# EasyEDA schematic SCH_Hunter_2024-12-30.json
TITLE: Hunter X-Core Monitor; REV: 1.0; Date: 2024-12-28; Sheet: 1/1; Drawn By: czsmith; Company: Christoher Smith
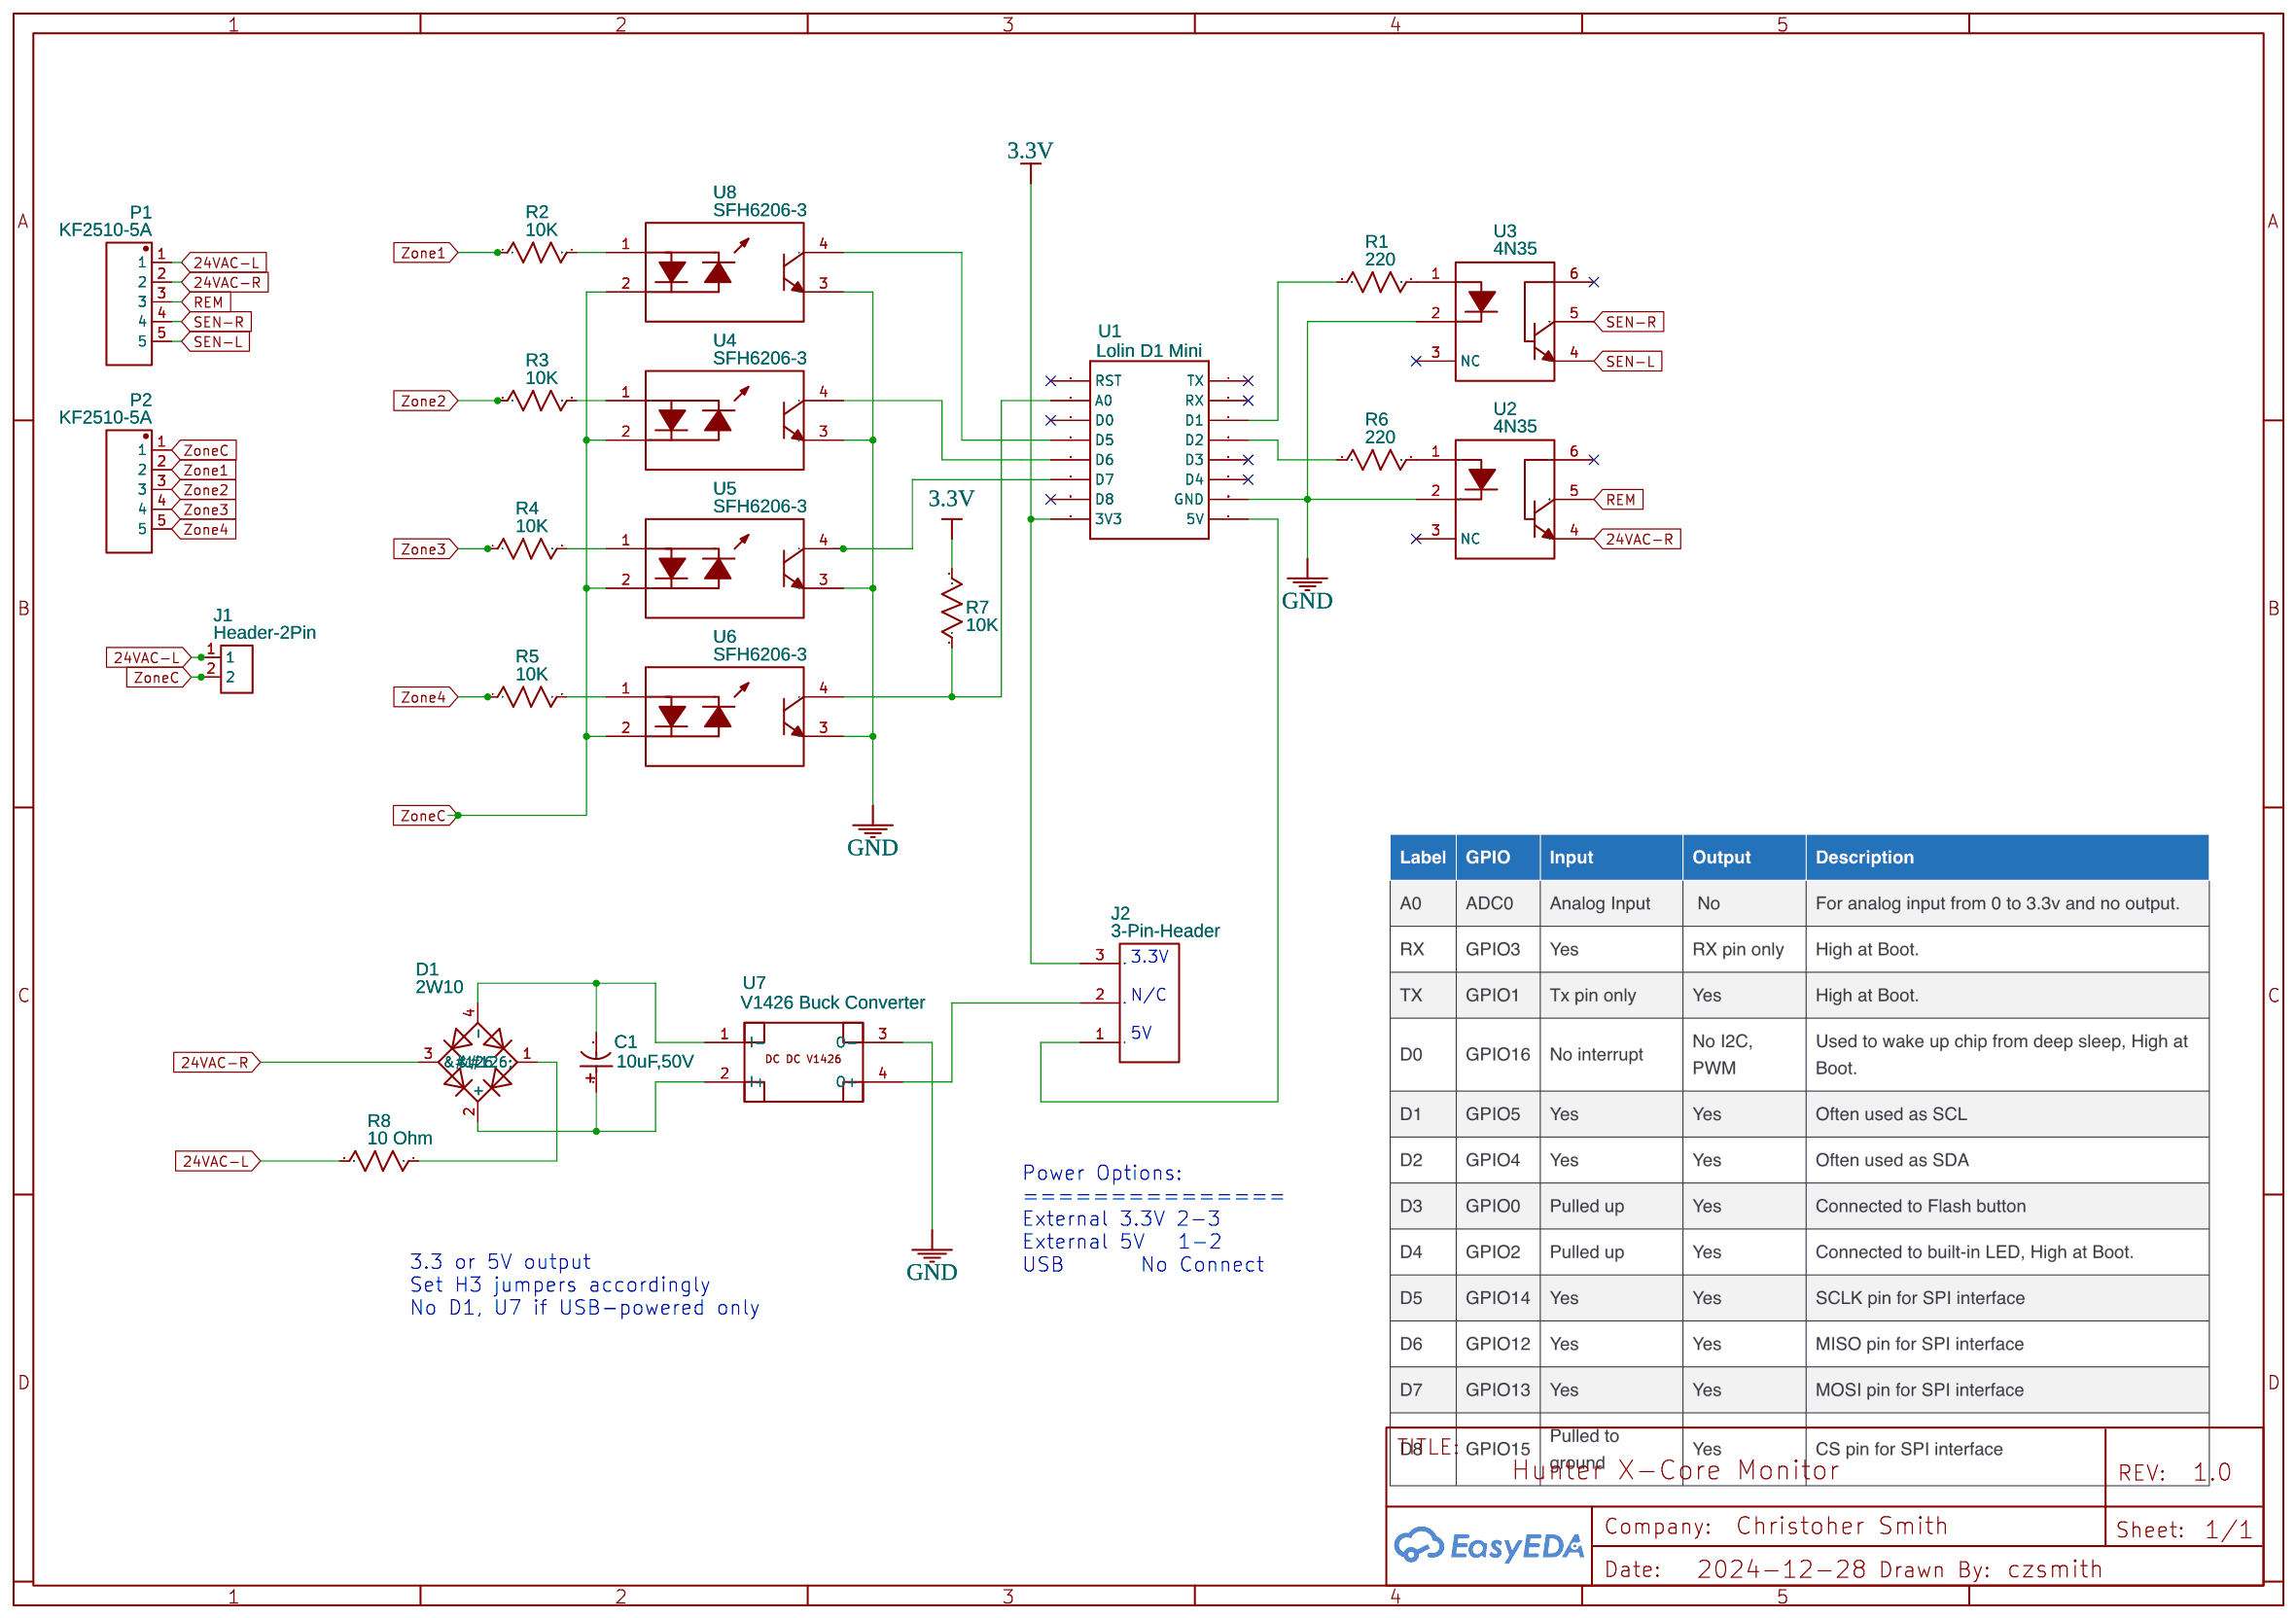
[diagram p0: schematic sheet]

## Parts
C1  10uF,50V  [CAP-TH_BD4.0-P1.50-D0.8-FD]
D1  2W10  [BRIDGE-WOB]
J1  Header-2Pin  [HEADER-2PIN]
J2  3-Pin-Header  [3-PIN-HEADER-FOOTPRINT]
P1  KF2510-5A  [CONN-TH_5P-P2.54_KF2510-5A]
P2  KF2510-5A  [CONN-TH_5P-P2.54_KF2510-5A]
R1  220  [R_AXIAL-0.4]
R2  10K  [R_AXIAL-0.4]
R3  10K  [R_AXIAL-0.4]
R4  10K  [R_AXIAL-0.4]
R5  10K  [R_AXIAL-0.4]
R6  220  [R_AXIAL-0.4]
R7  10K  [R_AXIAL-0.4]
R8  10 Ohm  [R_AXIAL-0.4]
U1  Lolin D1 Mini  [LOLIN D1 MINI]
U2  4N35  [DIP-6_L7.3-W6.5-P2.54-LS7.6-BL]
U3  4N35  [DIP-6_L7.3-W6.5-P2.54-LS7.6-BL]
U4  SFH6206-3  [DIP-4_L6.3-W5.0-P2.54-LS7.6-BL]
U5  SFH6206-3  [DIP-4_L6.3-W5.0-P2.54-LS7.6-BL]
U6  SFH6206-3  [DIP-4_L6.3-W5.0-P2.54-LS7.6-BL]
U7  V1426 Buck Converter  [V1426 CZS]
U8  SFH6206-3  [DIP-4_L6.3-W5.0-P2.54-LS7.6-BL]

## Library data of the parts
C1 = 4.7uF 50V 4*7: Supplier: LCSC; Manufacturer: CX(承兴); Manufacturer Part: KS475M050C07RR0VH2FP0; Supplier Part: C43841; JLCPCB Part Class: Extended Part
D1 = 2W10: Supplier: LCSC; Manufacturer: MDD; image: //image.lceda.cn/szlcsc/C3064.jpg; Supplier Part: C3064; link: D/doroteo; Contributor: Remedios Del Pozo
J1 = Header-2Pin: Manufacturer: Amphenol ICC (Commercial Products); Manufacturer Part: G800WC306018EU; Supplier Part: 664-G800WC306018EU-ND; Supplier: Digi-Key; link: https://www.digikey.kr/ko/products/detail/amphenol-icc-(commercial-products)/G800WC306018EU/17083163?utm_adgroup=&utm_source=google&utm_medium=cpc&utm_campaign=Pmax%20Shopping_Product_All&utm_term=&utm_content=&utm_id=go_cmp-21036528233_adg-_ad-__dev-c_ext-_prd-17083163_sig-Cj0KCQjw0Oq2BhCCARIsAA5hubWk9avkClM22Y4FmhcapBcfoQYxSe3OqXjJ02saBMR-8QIhNsJI0goaAoHpEALw_wcB&gad_source=1&gclid=Cj0KCQjw0Oq2BhCCARIsAA5hubWk9avkClM22Y4FmhcapBcfoQYxSe3OqXjJ02saBMR-8QIhNsJI0goaAoHpEALw_wcB; Contributor: wonkim
J2 = 3-Pin-Header: Supplier: reichelt; Contributor: Philipp
P1 P2 = KF2510-5A: Supplier: LCSC; Manufacturer: BOOMELE(博穆精密); Manufacturer Part: 2510-5A; Supplier Part: C27544; JLCPCB Part Class: Extended Part
R1-R8 = R_0603_US: Contributor: LCEDA_Lib; Package Display: No
U1 = Lolin D1 Mini: sourceId: YemgaslDx; Contributor: Marco Cè
U2 U3 = LTV-4N35: Contributor: LCSC; Supplier: LCSC; Supplier Part: C343878; Manufacturer: LITEON(光宝); JLCPCB Part Class: Extended Part
U4-U6 U8 = SFH6206-3: Supplier: LCSC; Supplier Part: C7473279; Manufacturer: VISHAY(威世); Contributor: lcsc; JLCPCB Part Class: Extended Part
U7 = DC DC Buck Stepdown 5-30V > 3.3V: Supplier: Ali Express; Contributor: obi9

## Nets
3.3V: J2.3 R7.2 U1.3V3
24VAC-L: J1.1 P1.1 R8.2
24VAC-R: D1.3(&#126;) P1.2 U2.4
GND: U1.GND U2.2 U3.2 U4.3 U5.3 U6.3 U7.3(O-) U8.3
REM: P1.3 U2.5
SEN-L: P1.5 U3.4
SEN-R: P1.4 U3.5
Zone1: P2.2 R2.1
Zone2: P2.3 R3.1
Zone3: P2.4 R4.1
Zone4: P2.5 R5.1
ZoneC: J1.2 P2.1 U4.2 U5.2 U6.2 U8.2
Net-(C1-1): C1.1 D1.2(+) U7.2(I+)
Net-(C1-2): C1.2 D1.4(-) U7.1(I-)
Net-(D1-1): D1.1(&#126;) R8.1
Net-(J2-1): J2.1 U1.5V
Net-(J2-2): J2.2 U7.4(O+)
Net-(R1-1): R1.1 U1.D1
Net-(R1-2): R1.2 U3.1
Net-(R2-2): R2.2 U8.1
Net-(R3-2): R3.2 U4.1
Net-(R4-2): R4.2 U5.1
Net-(R5-2): R5.2 U6.1
Net-(R6-1): R6.1 U1.D2
Net-(R6-2): R6.2 U2.1
Net-(R7-1): R7.1 U1.A0 U6.4
Net-(U1-D5): U1.D5 U8.4
Net-(U1-D6): U1.D6 U4.4
Net-(U1-D7): U1.D7 U5.4

Not connected (* = marked no-connect by the designer): U1 D0* D3* D4* D8* RST* RX* TX*; U2 3(NC)* 6(B)*; U3 3(NC)* 6(B)*

## Notes on the sheet
- 3.3V
  N/C
  5V
- Power Options:
  ===============
  External 3.3V 2-3
  External 5V   1-2
  USB       No Connect
- 3.3 or 5V output
  Set H3 jumpers accordingly
  No D1, U7 if USB-powered only
